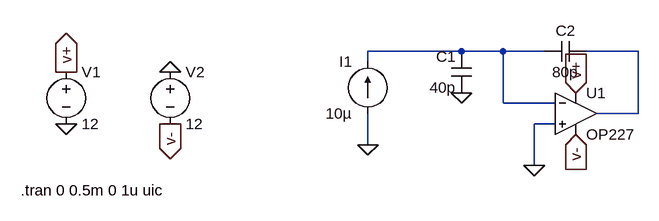
[diagram p0: schematic ChargeAmplifier.asc]
ChargeAmplifier.asc, the LTspice schematic file:
Version 4
SHEET 1 880 680
WIRE 192 -48 48 -48
WIRE 256 -48 192 -48
WIRE 320 -48 256 -48
WIRE 464 -48 384 -48
WIRE 48 -32 48 -48
WIRE 256 32 256 -48
WIRE 336 32 256 32
WIRE 464 48 464 -48
WIRE 464 48 400 48
WIRE 336 64 304 64
WIRE 48 96 48 48
WIRE 304 128 304 64
FLAG 304 128 0
FLAG -256 -16 0
FLAG -416 64 0
FLAG -416 -16 v+
IOPIN -416 -16 Out
FLAG -256 64 v-
IOPIN -256 64 Out
FLAG 368 16 v+
IOPIN 368 16 In
FLAG 368 80 v-
IOPIN 368 80 In
FLAG 48 96 0
FLAG 192 16 0
SYMBOL current 48 48 R180
WINDOW 0 24 80 Left 2
WINDOW 3 24 0 Left 2
WINDOW 123 0 0 Left 0
WINDOW 39 0 0 Left 0
SYMATTR InstName I1
SYMATTR Value 10µ
SYMBOL cap 208 16 R180
WINDOW 0 24 56 Left 2
WINDOW 3 24 8 Left 2
SYMATTR InstName C1
SYMATTR Value 40p
SYMBOL cap 384 -64 R90
WINDOW 0 0 32 VBottom 2
WINDOW 3 32 32 VTop 2
SYMATTR InstName C2
SYMATTR Value 80p
SYMBOL voltage -416 -32 R0
WINDOW 123 0 0 Left 0
WINDOW 39 0 0 Left 0
SYMATTR InstName V1
SYMATTR Value 12
SYMBOL voltage -256 -32 R0
WINDOW 123 0 0 Left 0
WINDOW 39 0 0 Left 0
SYMATTR InstName V2
SYMATTR Value 12
SYMBOL OpAmps\\OP227 368 -16 R0
SYMATTR InstName U1
TEXT -486 166 Left 2 !.tran 0 0.5m 0 1u uic

The netlist it stands for:
* ChargeAmplifier.asc
I1 0 N001 10µ
C1 0 N001 40p
C2 N002 N001 80p
V1 v+ 0 12
V2 0 v- 12
XU1 0 N001 v+ v- N002 OP227  ; pins In+ In- V+ V- OUT
.tran 0 0.5m 0 1u uic
.backanno
.end